# Altium project Ultrasonic_mbed.PrjPCB
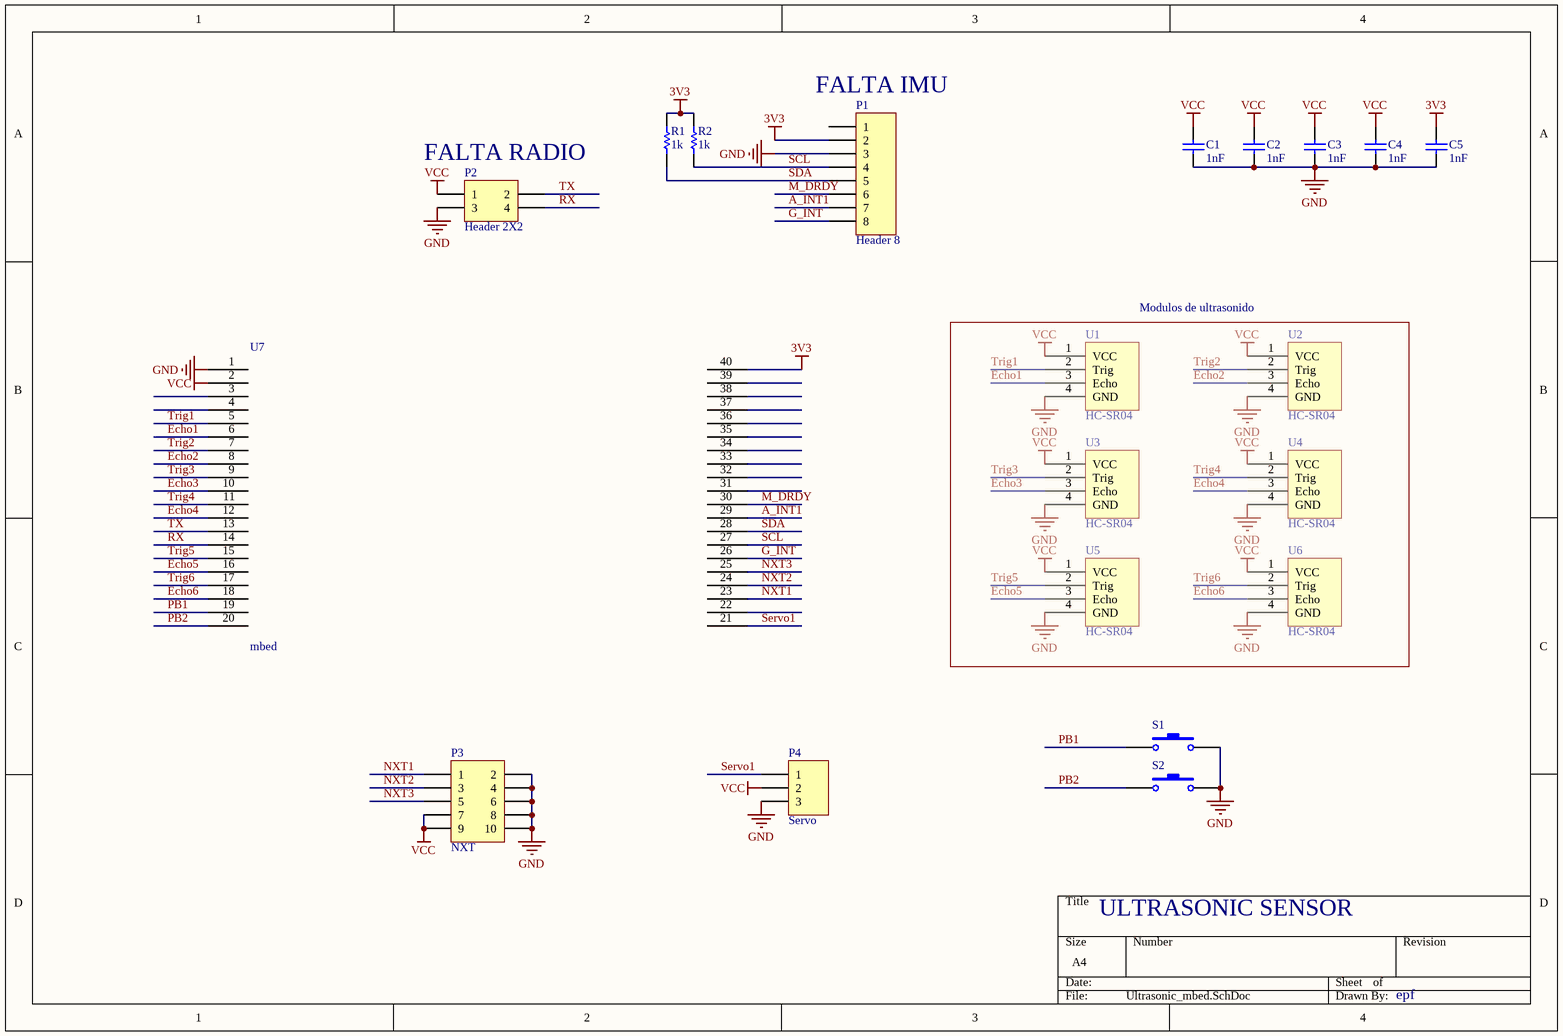
[diagram p0: Ultrasonic_mbed.SchDoc]
1 sheet, 20 parts. Net scope: global (net labels, ports and power ports of the same name join across sheets).
Board file: Ultrasonic_mbed.PcbDoc

## Sheet Ultrasonic_mbed.SchDoc
size A4

### Parts
C1  value 1nF  [CAP0805]  (hidden comment: Capacitor)
C2  value 1nF  [CAP0805]  (hidden comment: Capacitor)
C3  value 1nF  [CAP0805]  (hidden comment: Capacitor)
C4  value 1nF  [CAP0805]  (hidden comment: Capacitor)
C5  value 1nF  [CAP0805]  (hidden comment: Capacitor)
P1  Header 8  [HDR1X8]
P2  Header 2X2  [HDR2X2]
P3  NXT  [HDR2X5]
P4  Servo  [HDR1X3]
R1  value 1k  [RES0805]  (hidden comment: Resistor)
R2  value 1k  [RES0805]  (hidden comment: Resistor)
S1  SW-PB  [SW-PB6mm - 2]  (value not drawn)
S2  SW-PB  [SW-PB6mm - 2]  (value not drawn)
U1  HC-SR04  [HC-SR04]
U2  HC-SR04  [HC-SR04]
U3  HC-SR04  [HC-SR04]
U4  HC-SR04  [HC-SR04]
U5  HC-SR04  [HC-SR04]
U6  HC-SR04  [HC-SR04]
U7  mbed  [mbed]

### Blocks framed on the sheet
Modulos de ultrasonido: U1-U6

### Nets
3V3: C5.2 P1.2 R1.1 R2.1 U7.40
GND: C1.1 C2.1 C3.1 C4.1 C5.1 P1.3 P2.3 P3.2 P3.4 P3.6 P3.8 P3.10 P4.3 S1.2 S2.2 U1.4(GND) U2.4(GND) U3.4(GND) U4.4(GND) U5.4(GND) U6.4(GND) U7.1
VCC: C1.2 C2.2 C3.2 C4.2 P2.1 P3.7 P3.9 P4.2 U1.1(VCC) U2.1(VCC) U3.1(VCC) U4.1(VCC) U5.1(VCC) U6.1(VCC) U7.2
A_INT1: P1.7 U7.29
Echo1: U1.3(Echo) U7.6
Echo2: U2.3(Echo) U7.8
Echo3: U3.3(Echo) U7.10
Echo4: U4.3(Echo) U7.12
Echo5: U5.3(Echo) U7.16
Echo6: U6.3(Echo) U7.18
G_INT: P1.8 U7.26
M_DRDY: P1.6 U7.30
NXT1: P3.1 U7.23
NXT2: P3.3 U7.24
NXT3: P3.5 U7.25
PB1: S1.1 U7.19
PB2: S2.1 U7.20
RX: P2.4 U7.14
SCL: P1.4 R2.2 U7.27
SDA: P1.5 R1.2 U7.28
Servo1: P4.1 U7.21
Trig1: U1.2(Trig) U7.5
Trig2: U2.2(Trig) U7.7
Trig3: U3.2(Trig) U7.9
Trig4: U4.2(Trig) U7.11
Trig5: U5.2(Trig) U7.15
Trig6: U6.2(Trig) U7.17
TX: P2.2 U7.13

Not connected (* = marked no-connect by the designer): P1 1; U7 3 4 22 31 32 33 34 35 36 37 38 39

### Notes on the sheet
- (near P1) FALTA IMU
- (near P2) FALTA RADIO
- ULTRASONIC SENSOR
- epf

### Library data of the parts
C1-C5 = Cap
P1 = Header 8: Header, 8-Pin; LatestRevisionDate: 17-Jul-2002; LatestRevisionNote: Re-released for DXP Platform.; Publisher: Altium Limited
P2 = Header 2X2: Header, 2-Pin, Dual row; LatestRevisionDate: 17-Jul-2002; LatestRevisionNote: Re-released for DXP Platform.; Publisher: Altium Limited
P3 = Header 5X2: Header, 5-Pin, Dual row; LatestRevisionDate: 17-Jul-2002; LatestRevisionNote: Re-released for DXP Platform.; Publisher: Altium Limited
P4 = Header 3: Header, 3-Pin; LatestRevisionDate: 17-Jul-2002; LatestRevisionNote: Re-released for DXP Platform.; Publisher: Altium Limited
R1 R2 = Res
S1 S2 = SW-PB: Switch; Published: 24-Mar-1999; LatestRevisionDate: 17-Jul-2002; LatestRevisionNote: Re-released for DXP Platform.; PackageReference: SPST-2; Publisher: Altium Limited
U1-U6 = HC-SR04: Ultrasonic module